# EAGLE schematic digitaler_lautstärkeregler (EAGLE 8.0.1)
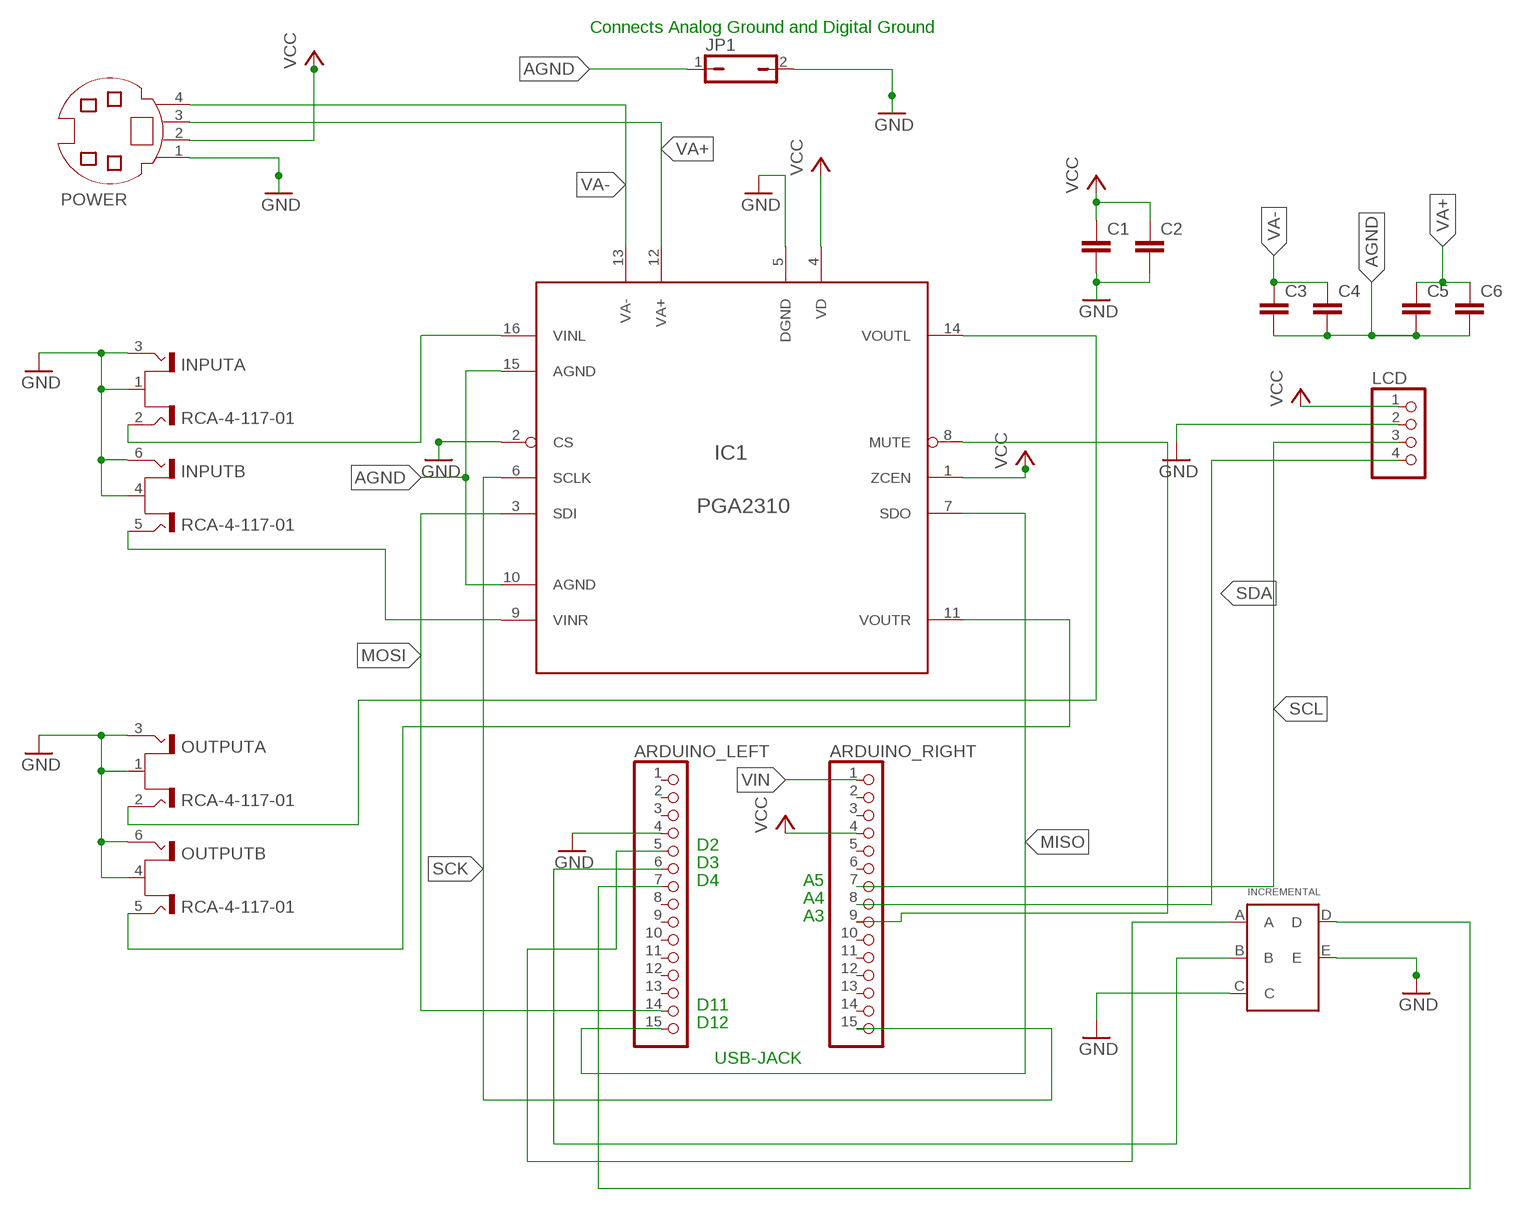
[diagram p0: schematic, sheet 1]

## Parts
ARDUINO_LEFT  PINHD-1X15  [1X15]
ARDUINO_RIGHT  PINHD-1X15  [1X15]
C1  C-EUC1206  [C1206]
C2  C-EUC1206  [C1206]
C3  C-EUC1206  [C1206]
C4  C-EUC1206  [C1206]
C5  C-EUC1206  [C1206]
C6  C-EUC1206  [C1206]
IC1  PGA2310  [DIL16]
INCREMENTAL  ENCODER  [ENCODER]
INPUT  RCA-4-117-01  [RCA-4-117-01]
JP1  JP1Q  [JP1]
LCD  PINHD-1X4  [1X04]
OUTPUT  RCA-4-117-01  [RCA-4-117-01]
POWER  MD04S  [MDIN04S]

## Nets
AGND: C3.2 C4.2 C5.2 C6.2 IC1.10(AGND) IC1.15(AGND) JP1.1
GND: ARDUINO_LEFT.4 C1.2 C2.2 IC1.2(CS) IC1.5(DGND) INCREMENTAL.C INCREMENTAL.E INPUT.1(A:S) INPUT.3(A:T2) INPUT.4(B:S) INPUT.6(B:T2) JP1.2 LCD.2 OUTPUT.1(A:S) OUTPUT.3(A:T2) OUTPUT.4(B:S) OUTPUT.6(B:T2) POWER.1
LEFTIN: IC1.16(VINL) INPUT.2(A:T1)
LEFTOUT: IC1.14(VOUTL) OUTPUT.2(A:T1)
MISO: ARDUINO_LEFT.15 IC1.7(SDO)
MOSI: ARDUINO_LEFT.14 IC1.3(SDI)
N$1: ARDUINO_RIGHT.9 IC1.8(MUTE)
N$3: ARDUINO_LEFT.7 INCREMENTAL.D
N$5: ARDUINO_LEFT.5 INCREMENTAL.A
N$6: ARDUINO_LEFT.6 INCREMENTAL.B
RIGHTIN: IC1.9(VINR)
RIGHTOUT: IC1.11(VOUTR) OUTPUT.5(B:T1)
SCK: ARDUINO_RIGHT.15 IC1.6(SCLK)
SCL: ARDUINO_RIGHT.7 LCD.3
SDA: ARDUINO_RIGHT.8 LCD.4
VA+: C5.1 C6.1 IC1.12(VA+) POWER.3
VA-: C3.1 C4.1 IC1.13(VA-) POWER.4
VCC: ARDUINO_RIGHT.4 C1.1 C2.1 IC1.1(ZCEN) IC1.4(VD) LCD.1 POWER.2
VIN: ARDUINO_RIGHT.1
Unconnected: ARDUINO_LEFT.1 ARDUINO_LEFT.2 ARDUINO_LEFT.3 ARDUINO_LEFT.8 ARDUINO_LEFT.9 ARDUINO_LEFT.10 ARDUINO_LEFT.11 ARDUINO_LEFT.12 ARDUINO_LEFT.13 ARDUINO_RIGHT.2 ARDUINO_RIGHT.3 ARDUINO_RIGHT.5 ARDUINO_RIGHT.6 ARDUINO_RIGHT.10 ARDUINO_RIGHT.11 ARDUINO_RIGHT.12 ARDUINO_RIGHT.13 ARDUINO_RIGHT.14 INPUT.5(B:T1)

## Notes on the sheet
- Connects Analog Ground and Digital Ground
- D2
- D3
- D4 | A5
- A4
- A3
- D11
- D12
- USB-JACK

## Library data of the parts
ARDUINO_LEFT ARDUINO_RIGHT = pinhead:PINHD-1X15: PIN HEADER
C1-C6 = resistor:C-EU: CAPACITOR, European symbol
IC1 = PGA2310:PGA2310
INCREMENTAL = encoder:ENCODER
INPUT OUTPUT = con-conrad:RCA-4-117-01: Cinch-Anschlussplatte 72385 Gold, Rot, Weiß BKL Electronic Conrad Bestellnummer : 736910 - 62 Source: Data sheet <http://www.produktinfo.conrad.com/datenblaetter/725000-749999/736910-da-01-en-Cinch_Anschlussplatte_4polig.pdf>
JP1 = jumper:JP1Q: JUMPER
LCD = pinhead:PINHD-1X4: PIN HEADER
POWER = con-yamaichi:MD04S: YAMAICHI CONNECTOR; OC_FARNELL: unknown; OC_NEWARK: unknown